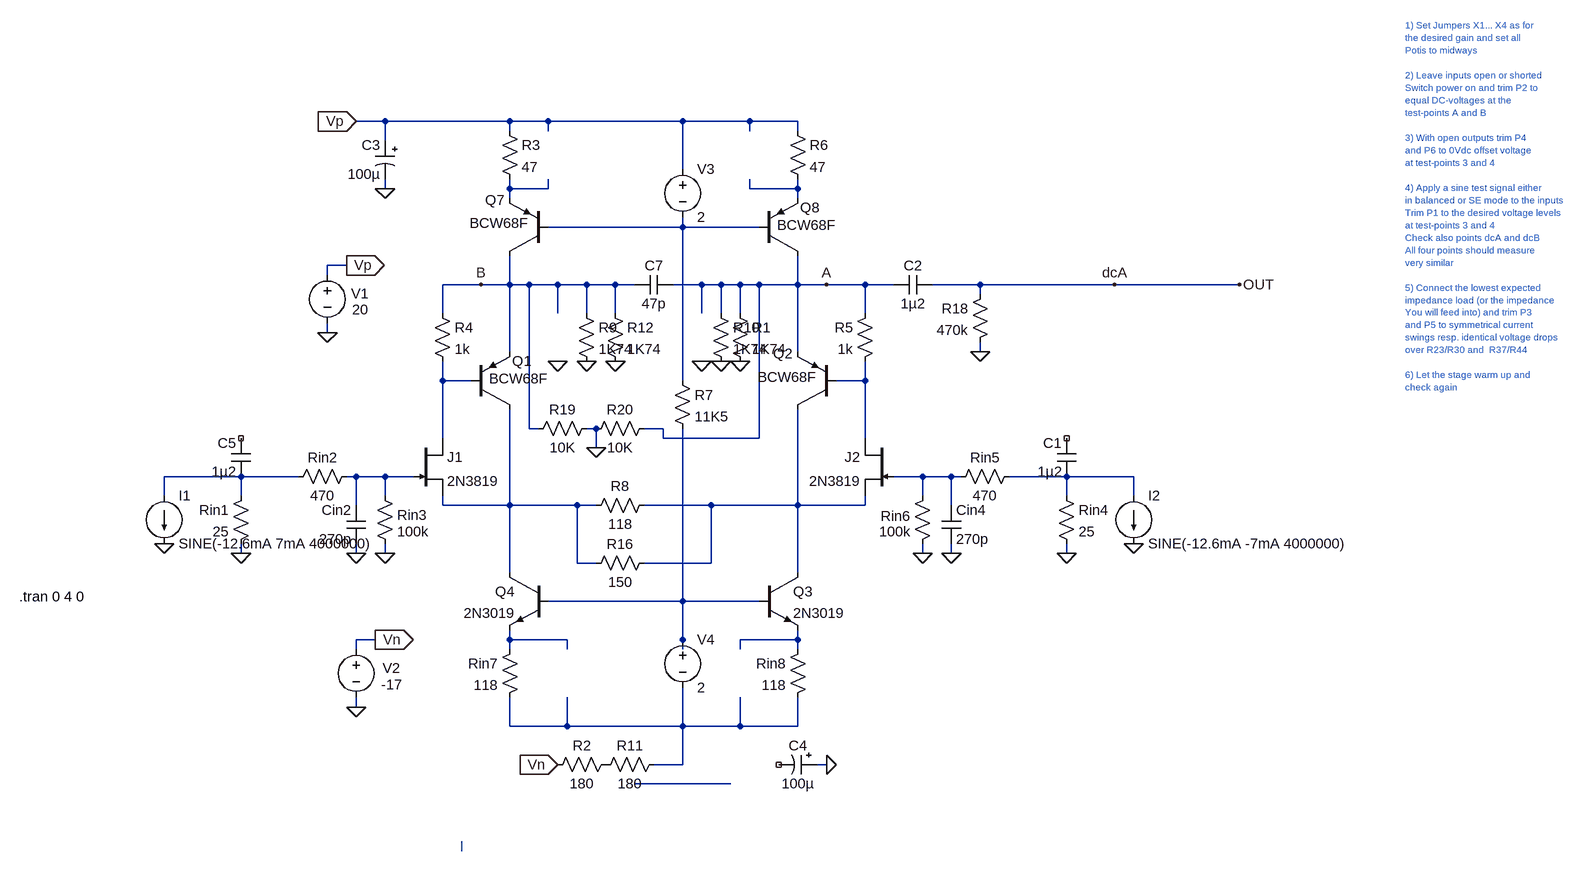
[diagram p0: schematic Calvins Gain Stage + Buffers.asc]
Calvins Gain Stage + Buffers.asc, the LTspice schematic file:
Version 4
SHEET 1 3648 1620
WIRE 624 176 576 176
WIRE 832 176 624 176
WIRE 896 176 832 176
WIRE 1120 176 896 176
WIRE 1232 176 1120 176
WIRE 1312 176 1232 176
WIRE 832 192 832 176
WIRE 896 192 896 176
WIRE 1232 192 1232 176
WIRE 1312 192 1312 176
WIRE 624 208 624 176
WIRE 1120 256 1120 176
WIRE 624 288 624 272
WIRE 832 288 832 272
WIRE 896 288 896 272
WIRE 896 288 832 288
WIRE 1232 288 1232 272
WIRE 1312 288 1312 272
WIRE 1312 288 1232 288
WIRE 832 304 832 288
WIRE 1312 304 1312 288
WIRE 1120 352 1120 336
WIRE 1120 352 896 352
WIRE 1248 352 1120 352
WIRE 560 416 528 416
WIRE 528 432 528 416
WIRE 784 448 720 448
WIRE 832 448 832 400
WIRE 832 448 784 448
WIRE 864 448 832 448
WIRE 912 448 864 448
WIRE 960 448 912 448
WIRE 1008 448 960 448
WIRE 1040 448 1008 448
WIRE 1152 448 1104 448
WIRE 1184 448 1152 448
WIRE 1216 448 1184 448
WIRE 1248 448 1216 448
WIRE 1312 448 1312 400
WIRE 1312 448 1248 448
WIRE 1360 448 1312 448
WIRE 1424 448 1360 448
WIRE 1472 448 1424 448
WIRE 1616 448 1536 448
WIRE 1840 448 1616 448
WIRE 2048 448 1840 448
WIRE 1616 464 1616 448
WIRE 720 496 720 448
WIRE 912 496 912 448
WIRE 960 496 960 448
WIRE 1008 496 1008 448
WIRE 1152 496 1152 448
WIRE 1184 496 1184 448
WIRE 1216 496 1216 448
WIRE 1424 496 1424 448
WIRE 528 528 528 512
WIRE 832 560 832 448
WIRE 1312 560 1312 448
WIRE 1616 560 1616 544
WIRE 720 608 720 576
WIRE 768 608 720 608
WIRE 1120 608 1120 352
WIRE 1424 608 1424 576
WIRE 1424 608 1376 608
WIRE 864 688 864 448
WIRE 880 688 864 688
WIRE 976 688 960 688
WIRE 1088 688 1056 688
WIRE 720 704 720 608
WIRE 1088 704 1088 688
WIRE 1248 704 1248 448
WIRE 1248 704 1088 704
WIRE 1424 704 1424 608
WIRE 976 720 976 688
WIRE 384 768 256 768
WIRE 480 768 384 768
WIRE 576 768 560 768
WIRE 624 768 576 768
WIRE 672 768 624 768
WIRE 1520 768 1472 768
WIRE 1568 768 1520 768
WIRE 1584 768 1568 768
WIRE 1760 768 1664 768
WIRE 1872 768 1760 768
WIRE 256 800 256 768
WIRE 384 800 384 768
WIRE 624 800 624 768
WIRE 1520 800 1520 768
WIRE 1760 800 1760 768
WIRE 1872 800 1872 768
WIRE 576 816 576 768
WIRE 720 816 720 800
WIRE 832 816 832 656
WIRE 832 816 720 816
WIRE 944 816 832 816
WIRE 976 816 944 816
WIRE 1168 816 1056 816
WIRE 1312 816 1312 656
WIRE 1312 816 1168 816
WIRE 1424 816 1424 800
WIRE 1424 816 1312 816
WIRE 1568 816 1568 768
WIRE 384 896 384 880
WIRE 576 896 576 880
WIRE 624 896 624 880
WIRE 1520 896 1520 880
WIRE 1568 896 1568 880
WIRE 1760 896 1760 880
WIRE 944 912 944 816
WIRE 976 912 944 912
WIRE 1168 912 1168 816
WIRE 1168 912 1056 912
WIRE 832 928 832 816
WIRE 1312 928 1312 816
WIRE 1120 976 1120 688
WIRE 1120 976 896 976
WIRE 1248 976 1120 976
WIRE 608 1040 576 1040
WIRE 832 1040 832 1024
WIRE 928 1040 832 1040
WIRE 1120 1040 1120 976
WIRE 1312 1040 1312 1024
WIRE 1312 1040 1216 1040
WIRE 576 1056 576 1040
WIRE 832 1056 832 1040
WIRE 928 1056 928 1040
WIRE 1120 1056 1120 1040
WIRE 1216 1056 1216 1040
WIRE 1312 1056 1312 1040
WIRE 576 1152 576 1136
WIRE 832 1184 832 1136
WIRE 928 1184 928 1136
WIRE 928 1184 832 1184
WIRE 1120 1184 1120 1120
WIRE 1120 1184 928 1184
WIRE 1216 1184 1216 1136
WIRE 1216 1184 1120 1184
WIRE 1312 1184 1312 1136
WIRE 1312 1184 1216 1184
WIRE 1120 1248 1120 1184
WIRE 1120 1248 1072 1248
WIRE 1360 1248 1344 1248
WIRE 1200 1280 1040 1280
FLAG 528 528 0
FLAG 560 416 Vp
IOPIN 560 416 Out
FLAG 608 1040 Vn
IOPIN 608 1040 Out
FLAG 576 1152 0
FLAG 624 896 0
FLAG 1520 896 0
FLAG 576 176 Vp
IOPIN 576 176 In
FLAG 912 1248 Vn
IOPIN 912 1248 In
FLAG 1616 560 0
FLAG 1360 1248 0
FLAG 784 448 B
FLAG 1360 448 A
FLAG 576 896 0
FLAG 1568 896 0
FLAG 384 896 0
FLAG 1760 896 0
FLAG 624 288 0
FLAG 1840 448 dcA
FLAG 256 880 0
FLAG 1872 880 0
FLAG 1184 576 0
FLAG 2048 448 OUT
FLAG 1152 576 0
FLAG 1008 576 0
FLAG 1216 576 0
FLAG 912 576 0
FLAG 976 720 0
FLAG 960 576 0
SYMBOL voltage 528 416 R0
WINDOW 0 40 47 Left 2
WINDOW 3 41 74 Left 2
WINDOW 123 0 0 Left 2
WINDOW 39 0 0 Left 2
SYMATTR InstName V1
SYMATTR Value 20
SYMBOL voltage 576 1040 R0
WINDOW 0 44 47 Left 2
WINDOW 3 42 75 Left 2
WINDOW 123 0 0 Left 2
WINDOW 39 0 0 Left 2
SYMATTR InstName V2
SYMATTR Value -17
SYMBOL res 608 784 R0
WINDOW 0 36 48 Left 2
SYMATTR InstName Rin3
SYMATTR Value 100k
SYMBOL res 1536 784 M0
WINDOW 0 36 50 Left 2
SYMATTR InstName Rin6
SYMATTR Value 100k
SYMBOL pnp 768 656 M180
WINDOW 0 68 80 Left 2
WINDOW 3 30 51 Left 2
SYMATTR InstName Q1
SYMATTR Value BCW68F
SYMBOL pnp 1376 656 R180
WINDOW 0 73 93 Left 2
WINDOW 3 33 54 Left 2
SYMATTR InstName Q2
SYMATTR Value BCW68F
SYMBOL res 704 480 R0
SYMATTR InstName R4
SYMATTR Value 1k
SYMBOL res 1440 480 M0
SYMATTR InstName R5
SYMATTR Value 1k
SYMBOL res 1632 448 M0
SYMATTR InstName R18
SYMATTR Value 470k
SYMBOL cap 1536 432 R90
WINDOW 0 0 32 VBottom 2
WINDOW 3 32 32 VTop 2
SYMATTR InstName C2
SYMATTR Value 1µ2
SYMBOL polcap 1344 1232 R90
WINDOW 0 0 32 VBottom 2
WINDOW 3 32 32 VTop 2
SYMATTR InstName C4
SYMATTR Value 100µ
SYMATTR Description Capacitor
SYMATTR Type cap
SYMATTR SpiceLine V=25 Irms=370m Rser=0.24 Lser=0 mfg="Nichicon" pn="UPL1E101MPH" type="Al electrolytic"
SYMBOL cap 592 816 M0
SYMATTR InstName Cin2
SYMATTR Value 270p
SYMBOL cap 1552 816 R0
SYMATTR InstName Cin4
SYMATTR Value 270p
SYMBOL res 464 784 R270
WINDOW 0 32 56 VTop 2
WINDOW 3 0 56 VBottom 2
SYMATTR InstName Rin2
SYMATTR Value 470
SYMBOL res 1568 784 R270
WINDOW 0 32 56 VTop 2
WINDOW 3 0 56 VBottom 2
SYMATTR InstName Rin5
SYMATTR Value 470
SYMBOL cap 1040 432 M90
WINDOW 0 0 32 VBottom 2
WINDOW 3 32 32 VTop 2
SYMATTR InstName C7
SYMATTR Value 47p
SYMBOL res 400 784 M0
SYMATTR InstName Rin1
SYMATTR Value 25
SYMBOL res 1744 784 R0
SYMATTR InstName Rin4
SYMATTR Value 25
SYMBOL polcap 640 208 M0
SYMATTR InstName C3
SYMATTR Value 100µ
SYMATTR Description Capacitor
SYMATTR Type cap
SYMATTR SpiceLine V=25 Irms=370m Rser=0.24 Lser=0 mfg="Nichicon" pn="UPL1E101MPH" type="Al electrolytic"
SYMBOL npn 896 928 M0
SYMATTR InstName Q4
SYMATTR Value 2N3019
SYMBOL pnp 896 400 R180
WINDOW 0 73 93 Left 2
WINDOW 3 33 54 Left 2
SYMATTR InstName Q7
SYMATTR Value BCW68F
SYMBOL pnp 1248 400 M180
WINDOW 0 68 80 Left 2
WINDOW 3 30 51 Left 2
SYMATTR InstName Q8
SYMATTR Value BCW68F
SYMBOL res 816 176 R0
SYMATTR InstName R3
SYMATTR Value 47
SYMBOL voltage 1120 240 R0
WINDOW 123 0 0 Left 2
WINDOW 39 0 0 Left 2
SYMATTR InstName V3
SYMATTR Value 2
SYMBOL res 1104 592 R0
SYMATTR InstName R7
SYMATTR Value 11K5
SYMBOL res 960 832 R270
WINDOW 0 32 56 VTop 2
WINDOW 3 0 56 VBottom 2
SYMATTR InstName R8
SYMATTR Value 118
SYMBOL npn 1248 928 R0
SYMATTR InstName Q3
SYMATTR Value 2N3019
SYMBOL res 848 1040 M0
SYMATTR InstName Rin7
SYMATTR Value 118
SYMBOL res 1328 1040 M0
SYMATTR InstName Rin8
SYMATTR Value 118
SYMBOL current 256 800 R0
WINDOW 123 0 0 Left 2
WINDOW 39 0 0 Left 2
SYMATTR InstName I1
SYMATTR Value SINE(-12.6mA 7mA 4000000)
SYMBOL current 1872 800 R0
WINDOW 123 0 0 Left 2
WINDOW 39 0 0 Left 2
SYMATTR InstName I2
SYMATTR Value SINE(-12.6mA -7mA 4000000)
SYMBOL res 1200 480 R0
SYMATTR InstName R1
SYMATTR Value 1K74
SYMBOL res 1088 1232 R90
WINDOW 0 0 56 VBottom 2
WINDOW 3 32 56 VTop 2
SYMATTR InstName R11
SYMATTR Value 180
SYMBOL res 1296 176 R0
SYMATTR InstName R6
SYMATTR Value 47
SYMBOL res 992 480 R0
SYMATTR InstName R12
SYMATTR Value 1K74
SYMBOL res 976 672 R90
WINDOW 0 0 56 VBottom 2
WINDOW 3 32 56 VTop 2
SYMATTR InstName R19
SYMATTR Value 10K
SYMBOL res 1072 672 R90
WINDOW 0 0 56 VBottom 2
WINDOW 3 32 56 VTop 2
SYMATTR InstName R20
SYMATTR Value 10K
SYMBOL cap 1776 768 R180
WINDOW 0 24 56 Left 2
WINDOW 3 24 8 Left 2
SYMATTR InstName C1
SYMATTR Value 1µ2
SYMBOL cap 400 768 R180
WINDOW 0 24 56 Left 2
WINDOW 3 24 8 Left 2
SYMATTR InstName C5
SYMATTR Value 1µ2
SYMBOL res 960 928 R270
WINDOW 0 32 56 VTop 2
WINDOW 3 0 56 VBottom 2
SYMATTR InstName R16
SYMATTR Value 150
SYMBOL njf 672 704 R0
SYMATTR InstName J1
SYMATTR Value 2N3819
SYMBOL njf 1472 704 M0
SYMATTR InstName J2
SYMATTR Value 2N3819
SYMBOL res 944 480 R0
SYMATTR InstName R9
SYMATTR Value 1K74
SYMBOL res 1168 480 R0
SYMATTR InstName R10
SYMATTR Value 1K74
SYMBOL voltage 1120 1024 R0
WINDOW 123 0 0 Left 2
WINDOW 39 0 0 Left 2
SYMATTR InstName V4
SYMATTR Value 2
SYMBOL res 1008 1232 R90
WINDOW 0 0 56 VBottom 2
WINDOW 3 32 56 VTop 2
SYMATTR InstName R2
SYMATTR Value 180
TEXT 2656 16 Left 1 ;1) Set Jumpers X1... X4 as for\nthe desired gain and set all\nPotis to midways\n \n2) Leave inputs open or shorted\nSwitch power on and trim P2 to\nequal DC-voltages at the\ntest-points A and B\n \n3) With open outputs trim P4\nand P6 to 0Vdc offset voltage\nat test-points 3 and 4\n \n4) Apply a sine test signal either\nin balanced or SE mode to the inputs\nTrim P1 to the desired voltage levels\nat test-points 3 and 4\nCheck also points dcA and dcB\nAll four points should measure\nvery similar\n \n5) Connect the lowest expected\nimpedance load (or the impedance\nYou will feed into) and trim P3\nand P5 to symmetrical current\nswings resp. identical voltage drops\nover R23/R30 and  R37/R44\n \n6) Let the stage warm up and\ncheck again
TEXT -464 968 Left 2 !.tran 0 4 0
CIRCLE Normal 752 1376 752 1392 2

The netlist it stands for:
* Calvins Gain Stage + Buffers.asc
V1 Vp 0 20
V2 Vn 0 -17
Rin3 N007 0 100k
Rin6 N008 0 100k
Q1 N010 N004 B 0 BCW68F
Q2 N011 N005 A 0 BCW68F
R4 B N004 1k
R5 A N005 1k
R18 OUT 0 470k
C2 OUT A 1µ2
C4 0 NC_01 100µ V=25 Irms=370m Rser=0.24 Lser=0 mfg="Nichicon" pn="UPL1E101MPH" type="Al electrolytic"
Cin2 N007 0 270p
Cin4 N008 0 270p
Rin2 N006 N007 470
Rin5 N008 N009 470
C7 B A 47p
Rin1 N006 0 25
Rin4 N009 0 25
C3 Vp 0 100µ V=25 Irms=370m Rser=0.24 Lser=0 mfg="Nichicon" pn="UPL1E101MPH" type="Al electrolytic"
Q4 N010 N012 N013 0 2N3019
Q7 B N003 N001 0 BCW68F
Q8 A N003 N002 0 BCW68F
R3 Vp N001 47
V3 Vp N003 2
R7 N003 N012 11K5
R8 N010 N011 118
Q3 N011 N012 N014 0 2N3019
Rin7 N013 N015 118
Rin8 N014 N015 118
I1 N006 0 SINE(-12.6mA 7mA 4000000)
I2 N009 0 SINE(-12.6mA -7mA 4000000)
R1 A 0 1K74
R11 N015 P001 180
R6 Vp N002 47
R12 B 0 1K74
R19 0 B 10K
R20 A 0 10K
C1 N009 NC_02 1µ2
C5 N006 NC_03 1µ2
R16 N010 N011 150
J1 N004 N007 N010 2N3819
J2 N005 N008 N011 2N3819
R9 B 0 1K74
R10 A 0 1K74
V4 N012 N015 2
R2 P001 Vn 180
.model NPN NPN
.model PNP PNP
.lib standard.bjt
.model NJF NJF
.model PJF PJF
.lib standard.jft
* 1) Set Jumpers X1... X4 as for
* the desired gain and set all
* Potis to midways
* 2) Leave inputs open or shorted
* Switch power on and trim P2 to
* equal DC-voltages at the
* test-points A and B
* 3) With open outputs trim P4
* and P6 to 0Vdc offset voltage
* at test-points 3 and 4
* 4) Apply a sine test signal either
* in balanced or SE mode to the inputs
* Trim P1 to the desired voltage levels
* at test-points 3 and 4
* Check also points dcA and dcB
* All four points should measure
* very similar
* 5) Connect the lowest expected
* impedance load (or the impedance
* You will feed into) and trim P3
* and P5 to symmetrical current
* swings resp. identical voltage drops
* over R23/R30 and  R37/R44
* 6) Let the stage warm up and
* check again
.tran 0 4 0
.backanno
.end